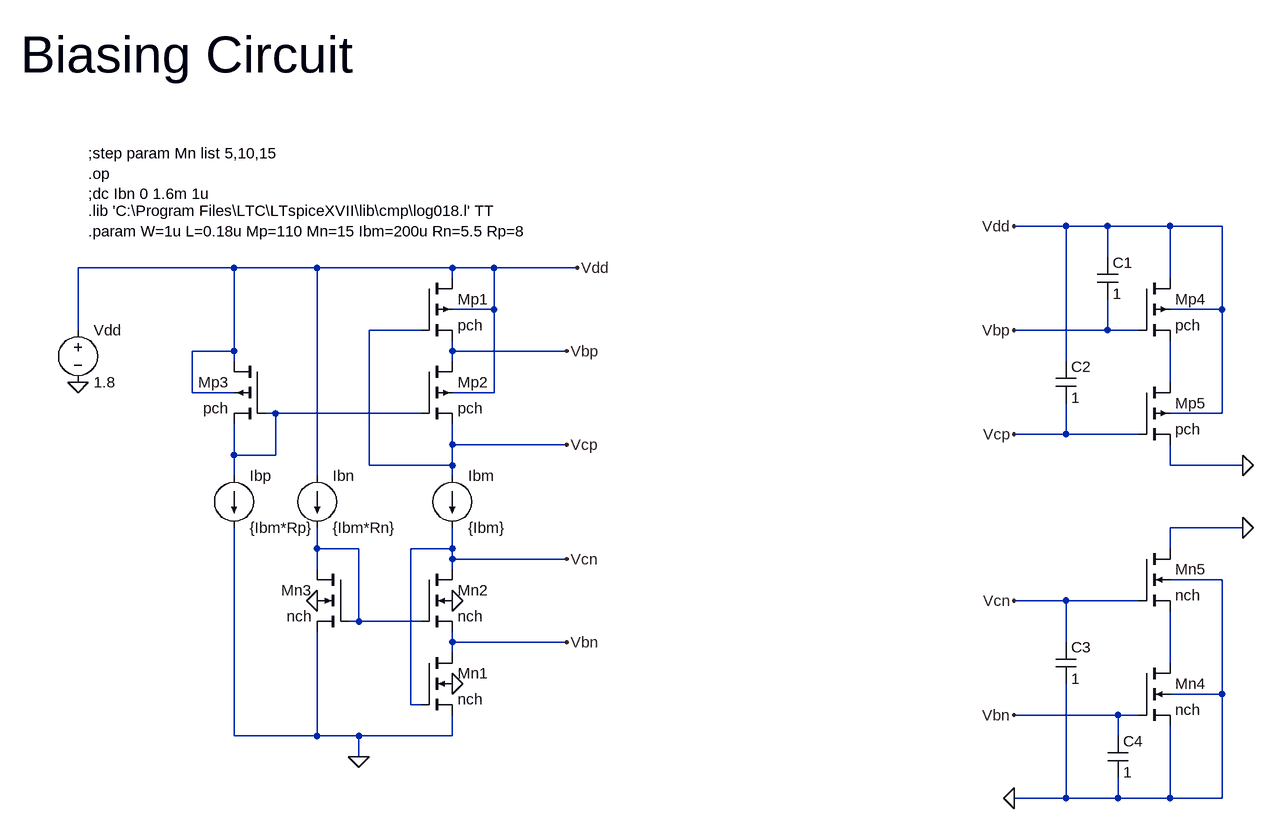
[diagram p0: schematic Simulation_2.asc]
Simulation_2.asc, the LTspice schematic file:
Version 4
SHEET 1 1476 740
WIRE 1184 -160 1104 -160
WIRE 1248 -160 1184 -160
WIRE 1344 -160 1248 -160
WIRE 1424 -160 1344 -160
WIRE 1248 -112 1248 -160
WIRE -96 -96 -336 -96
WIRE 32 -96 -96 -96
WIRE 240 -96 32 -96
WIRE 304 -96 240 -96
WIRE 432 -96 304 -96
WIRE 240 -80 240 -96
WIRE 1344 -80 1344 -160
WIRE 304 -32 304 -96
WIRE 304 -32 240 -32
WIRE 1424 -32 1424 -160
WIRE 1424 -32 1344 -32
WIRE -336 0 -336 -96
WIRE 192 0 112 0
WIRE 1248 0 1248 -48
WIRE 1248 0 1104 0
WIRE 1296 0 1248 0
WIRE -96 32 -96 -96
WIRE -96 32 -160 32
WIRE 240 32 240 16
WIRE 416 32 240 32
WIRE -96 48 -96 32
WIRE 240 48 240 32
WIRE 1184 48 1184 -160
WIRE 1344 80 1344 16
WIRE -160 96 -160 32
WIRE -96 96 -160 96
WIRE 304 96 304 -32
WIRE 304 96 240 96
WIRE -32 128 -48 128
WIRE 192 128 -32 128
WIRE 1424 128 1424 -32
WIRE 1424 128 1344 128
WIRE 1184 160 1184 112
WIRE 1184 160 1104 160
WIRE 1296 160 1184 160
WIRE 240 176 240 144
WIRE 416 176 240 176
WIRE -96 192 -96 144
WIRE -32 192 -32 128
WIRE -32 192 -96 192
WIRE 112 208 112 0
WIRE 240 208 240 176
WIRE 240 208 112 208
WIRE 1344 208 1344 176
WIRE 1456 208 1344 208
WIRE -96 224 -96 192
WIRE 32 224 32 -96
WIRE 240 224 240 208
WIRE 1456 304 1344 304
WIRE 32 336 32 304
WIRE 96 336 32 336
WIRE 240 336 240 304
WIRE 240 336 176 336
WIRE 1344 336 1344 304
WIRE 240 352 240 336
WIRE 416 352 240 352
WIRE 32 368 32 336
WIRE 240 368 240 352
WIRE 1424 384 1344 384
WIRE 1184 416 1104 416
WIRE 1296 416 1184 416
WIRE 96 448 96 336
WIRE 96 448 80 448
WIRE 192 448 96 448
WIRE 240 480 240 464
WIRE 416 480 240 480
WIRE 1184 480 1184 416
WIRE 240 496 240 480
WIRE 1344 512 1344 432
WIRE 1424 560 1424 384
WIRE 1424 560 1344 560
WIRE 176 576 176 336
WIRE 192 576 176 576
WIRE 1264 592 1104 592
WIRE 1296 592 1264 592
WIRE -96 624 -96 304
WIRE 32 624 32 464
WIRE 32 624 -96 624
WIRE 96 624 32 624
WIRE 240 624 240 592
WIRE 240 624 96 624
WIRE 1264 624 1264 592
WIRE 96 656 96 624
WIRE 1184 720 1184 544
WIRE 1184 720 1104 720
WIRE 1264 720 1264 688
WIRE 1264 720 1184 720
WIRE 1344 720 1344 608
WIRE 1344 720 1264 720
WIRE 1424 720 1424 560
WIRE 1424 720 1344 720
FLAG 96 656 0
FLAG 240 544 0
FLAG 240 416 0
FLAG 32 416 0
FLAG -336 80 0
FLAG 416 32 Vbp
FLAG 416 176 Vcp
FLAG 416 352 Vcn
FLAG 416 480 Vbn
FLAG 432 -96 Vdd
FLAG 1104 -160 Vdd
FLAG 1104 0 Vbp
FLAG 1104 160 Vcp
FLAG 1104 416 Vcn
FLAG 1104 592 Vbn
FLAG 1104 720 0
FLAG 1456 208 0
FLAG 1456 304 0
SYMBOL pmos4 192 -80 R0
SYMATTR InstName Mp1
SYMATTR Value pch
SYMATTR Value2 l=L w=W m=Mp
SYMBOL pmos4 192 48 R0
SYMATTR InstName Mp2
SYMATTR Value pch
SYMATTR Value2 l=L w=W m=Mp
SYMBOL pmos4 -48 48 M0
SYMATTR InstName Mp3
SYMATTR Value pch
SYMATTR Value2 l=L w=W m=Mp
SYMBOL nmos4 192 496 R0
SYMATTR InstName Mn1
SYMATTR Value nch
SYMATTR Value2 l=L w=W m={Mn}
SYMBOL nmos4 192 368 R0
SYMATTR InstName Mn2
SYMATTR Value nch
SYMATTR Value2 l=L w=W m={Mn}
SYMBOL nmos4 80 368 M0
SYMATTR InstName Mn3
SYMATTR Value nch
SYMATTR Value2 l=L w=W m={Mn}
SYMBOL voltage -336 -16 R0
SYMATTR InstName Vdd
SYMATTR Value 1.8
SYMBOL current 240 224 R0
SYMATTR InstName Ibm
SYMATTR Value {Ibm}
SYMBOL current 32 224 R0
WINDOW 123 0 0 Left 0
WINDOW 39 0 0 Left 0
SYMATTR InstName Ibn
SYMATTR Value {Ibm*Rn}
SYMBOL current -96 224 R0
WINDOW 123 0 0 Left 0
WINDOW 39 0 0 Left 0
SYMATTR InstName Ibp
SYMATTR Value {Ibm*Rp}
SYMBOL pmos4 1296 -80 R0
SYMATTR InstName Mp4
SYMATTR Value pch
SYMATTR Value2 l=L w=W m=Mp
SYMBOL pmos4 1296 80 R0
SYMATTR InstName Mp5
SYMATTR Value pch
SYMATTR Value2 l=L w=W m=Mp
SYMBOL nmos4 1296 336 R0
SYMATTR InstName Mn5
SYMATTR Value nch
SYMATTR Value2 l=L w=W m=Mn
SYMBOL nmos4 1296 512 R0
SYMATTR InstName Mn4
SYMATTR Value nch
SYMATTR Value2 l=L w=W m=Mn
SYMBOL cap 1232 -112 R0
SYMATTR InstName C1
SYMATTR Value 1
SYMBOL cap 1168 48 R0
SYMATTR InstName C2
SYMATTR Value 1
SYMBOL cap 1168 480 R0
SYMATTR InstName C3
SYMATTR Value 1
SYMBOL cap 1248 624 R0
SYMATTR InstName C4
SYMATTR Value 1
TEXT -320 -152 Left 2 !.param W=1u L=0.18u Mp=110 Mn=15 Ibm=200u Rn=5.5 Rp=8
TEXT -320 -272 Left 2 !;step param Mn list 5,10,15\n.op\n;dc Ibn 0 1.6m 1u
TEXT -320 -184 Left 2 !.lib 'C:\\Program Files\\LTC\\LTspiceXVII\\lib\\cmp\\log018.l' TT
TEXT -424 -424 Left 6 !Biasing Circuit

The netlist it stands for:
* Simulation_2.asc
Mp1 Vdd Vcp Vbp Vdd pch l=L w=W m=Mp
Mp2 Vbp N002 Vcp Vdd pch l=L w=W m=Mp
Mp3 Vdd N002 N002 Vdd pch l=L w=W m=Mp
Mn1 Vbn Vcn 0 0 nch l=L w=W m={Mn}
Mn2 Vcn N003 Vbn 0 nch l=L w=W m={Mn}
Mn3 N003 N003 0 0 nch l=L w=W m={Mn}
Vdd Vdd 0 1.8
Ibm Vcp Vcn {Ibm}
Ibn Vdd N003 {Ibm*Rn}
Ibp N002 0 {Ibm*Rp}
Mp4 Vdd Vbp N001 Vdd pch l=L w=W m=Mp
Mp5 N001 Vcp 0 Vdd pch l=L w=W m=Mp
Mn5 0 Vcn N004 0 nch l=L w=W m=Mn
Mn4 N004 Vbn 0 0 nch l=L w=W m=Mn
C1 Vdd Vbp 1
C2 Vdd Vcp 1
C3 Vcn 0 1
C4 Vbn 0 1
.model NMOS NMOS
.model PMOS PMOS
.lib standard.mos
.param W=1u L=0.18u Mp=110 Mn=15 Ibm=200u Rn=5.5 Rp=8
;step param Mn list 5,10,15
.op
;dc Ibn 0 1.6m 1u
.lib 'C:\Program Files\LTC\LTspiceXVII\lib\cmp\log018.l' TT
Biasing Circuit
.backanno
.end